# EAGLE design H-bro_gear (EAGLE 6.3)
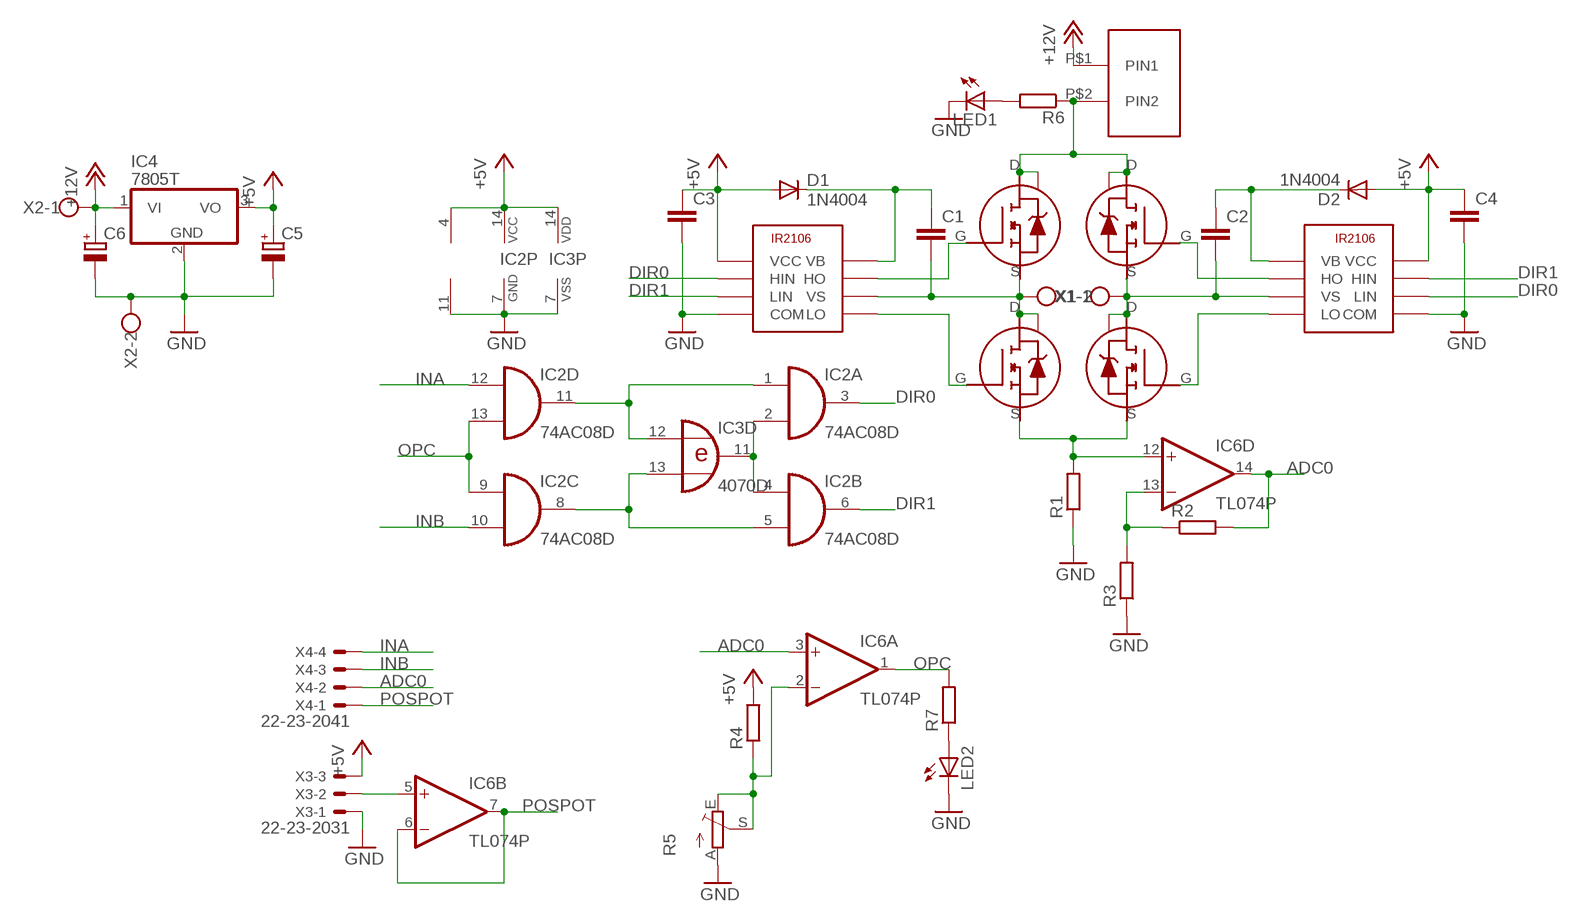
[diagram p0: schematic, sheet 1]

## Parts
C1  C-EU050-025X075  [C050-025X075]
C2  C-EU050-025X075  [C050-025X075]
C3  C-EU050-025X075  [C050-025X075]
C4  C-EU050-025X075  [C050-025X075]
C5  CPOL-EUE15-5AXIAL  [E15-5]
C6  CPOL-EUE15-5AXIAL  [E15-5]
D1  1N4004  [DO41-10]
D2  1N4004  [DO41-10]
IC2  74AC08D  [SO14]
IC3  4070D  [SO14]
IC4  7805T  [TO220H]
IC6  TL074P  [DIL14]
LED1  LED5MM  [LED5MM]
LED2  LED5MM  [LED5MM]
R1  R-EU_0309/12  [0309/12]
R2  R-EU_0204/7  [0204/7]
R3  R-EU_0204/7  [0204/7]
R4  R-EU_0204/7  [0204/7]
R5  TRIM_EU-RJ9W  [RJ9W]
R6  R-EU_0204/7  [0204/7]
R7  R-EU_0204/7  [0204/7]
U$1  IR2106  [IR2106]
U$2  IR2106  [IR2106]
U$3  STU95N5  [STU95N5]
U$4  STU95N5  [STU95N5]
U$5  STU95N5  [STU95N5]
U$6  STU95N5  [STU95N5]
U$7  LITTE_FUSE  [LITTE_FUSE_PAC]
X1  W237-102  [W237-102]
X2  W237-102  [W237-102]
X3  22-23-2031  [22-23-2031]
X4  22-23-2041  [22-23-2041]

## Nets
+5V: C3.1 C4.1 C5.+ D1.A D2.A IC2.14(P:VCC) IC3.14(P:VDD) IC4.3(VO) IC6.4(P:V+) R4.2 U$1.VCC U$2.VCC X3.3
+12V: C6.+ IC4.1(VI) U$7.P$1(PIN1) X2.1
ADC0: IC6.3(A:+IN) IC6.14(D:OUT) R2.2 X4.2
DIR0: IC2.3(A:O) U$1.HIN U$2.LIN
DIR1: IC2.6(B:O) U$1.LIN U$2.HIN
GND: C3.2 C4.2 C5.- C6.- IC2.7(P:GND) IC3.7(P:VSS) IC4.2(GND) IC6.11(P:V-) LED1.K(C) LED2.K(C) R1.1 R3.1 R5.A U$1.COM U$2.COM X2.2 X3.1
INA: IC2.12(D:I0) X4.4
INB: IC2.10(C:I1) X4.3
N$1: U$1.HO U$3.G
N$2: U$1.LO U$4.G
N$3: U$2.HO U$6.G
N$4: U$2.LO U$5.G
N$6: C1.2 U$1.VS U$3.S U$4.D U$4.TAB X1.2
N$7: C2.2 U$2.VS U$5.D U$5.TAB U$6.S X1.1
N$9: R6.1 U$3.D U$3.TAB U$6.D U$6.TAB U$7.P$2(PIN2)
N$10: C1.1 D1.C U$1.VB
N$11: IC6.12(D:+IN) R1.2 U$4.S U$5.S
N$13: C2.1 D2.C U$2.VB
N$15: IC2.2(A:I1) IC2.4(B:I0) IC3.11(D:O)
N$16: IC2.1(A:I0) IC2.11(D:O) IC3.12(D:I0)
N$17: IC2.5(B:I1) IC2.8(C:O) IC3.13(D:I1)
N$18: IC6.2(A:-IN) R4.1 R5.E R5.S
N$19: LED1.A R6.2
N$20: IC6.5(B:+IN) X3.2
N$21: IC6.13(D:-IN) R2.1 R3.2
N$22: LED2.A R7.1
OPC: IC2.9(C:I0) IC2.13(D:I1) IC6.1(A:OUT) R7.2
POSPOT: IC6.6(B:-IN) IC6.7(B:OUT) X4.1
Unconnected: IC3.1(A:I0) IC3.2(A:I1) IC3.3(A:O) IC3.4(B:O) IC3.5(B:I0) IC3.6(B:I1) IC3.8(C:I0) IC3.9(C:I1) IC3.10(C:O) IC6.8(C:OUT) IC6.9(C:-IN) IC6.10(C:+IN)

## Library data of the parts
C1-C4 = rcl:C-EU: CAPACITOR, European symbol
C5 C6 = rcl:CPOL-EU: POLARIZED CAPACITOR, European symbol
D1 D2 = diode:1N4004: DIODE general purpose rectifier, 1 A
IC2 = 74xx-eu:74*08: Quad 2-input AND gate
IC3 = 40xx:4070: Quad 2-input XOR
IC4 = linear:78*: Positive VOLTAGE REGULATOR Source: http://cache.national.com/ds/LM/LM78L05.pdf http://www.fairchildsemi.com/ds/LM/LM7805.pdf
IC6 = linear:TL074: OP AMP
LED1 LED2 = adafruit:LED: LED OSRAM: - CHIPLED LG R971, LG N971, LY N971, LG Q971, LY Q971, LO R971, LY R971 LH N974, LH R974 LS Q976, LO Q976, LY Q976 LO Q996 - Hyper CHIPLED LW Q18S LB Q993, LB Q99A, LB R99A - SideLED LS A670, LO A670, LY A670, LG A670, LP A670 LB A673, LV A673, LT A673, LW A673 LH A674 LY A675 LS A676, LA A676, LO A676, LY A676, LW A676 LS A679, LY A679, LG A679 - Hyper Micro SIDELED® LS Y876, LA Y876, LO Y876, LY Y876 LT Y87S - SmartLED LW L88C, LW L88S LB L89C, LB L89S, LG L890 LS L89K, LO L89K, LY L89K LS L896, LA L896, LO L896, LY L896 - TOPLED LS T670, LO T670, LY T670, LG T670, LP T670 LSG T670, LSP T670, LSY T670, LOP T670, LYG T670 LG T671, LOG T671, LSG T671 LB T673, LV T673, LT T673, LW T673 LH T674 LS T676, LA T676, LO T676, LY T676, LB T676, LH T676, LSB T676, LW T676 LB T67C, LV T67C, LT T67C, LS T67K, LO T67K, LY T67K, LW E67C LS E67B, LA E67B, LO E67B, LY E67B, LB E67C, LV E67C, LT E67C LW T67C LS T679, LY T679, LG T679 LS T770, LO T770, LY T770, LG T770, LP T770 LB T773, LV T773, LT T773, LW T773 LH T774 LS E675, LA E675, LY E675, LS T675 LS T776, LA T776, LO T776, LY T776, LB T776 LHGB T686 LT T68C, LB T68C - Hyper Mini TOPLED® LB M676 - Mini TOPLED Santana® LG M470 LS M47K, LO M47K, LY M47K Source: http://www.osram.convergy.de/
R1 = resistor:R-EU_: RESISTOR, European symbol
R2-R4 R6 R7 = rcl:R-EU_: RESISTOR, European symbol
R5 = pot:TRIM_EU-: POTENTIOMETER
U$1 U$2 = IR2106:IR2106; DEVICE: IR2106
U$3-U$6 = Brushless-motor-controller:STU95N5
U$7 = unicorn_v2:LITTE_FUSE
X1 X2 = con-wago-500:W237-102: WAGO SCREW CLAMP; MPN: 237-102; OC_FARNELL: unknown; OC_NEWARK: 70K9898
X3 = con-molex:22-23-2031: .100" (2.54mm) Center Header - 3 Pin; MF: MOLEX; MPN: 22-23-2031; OC_FARNELL: 1462950; OC_NEWARK: 30C0862
X4 = con-molex:22-23-2041: .100" (2.54mm) Center Header - 4 Pin; MF: MOLEX; MPN: 22-23-2041; OC_FARNELL: 1462920; OC_NEWARK: 38C0355

## Board
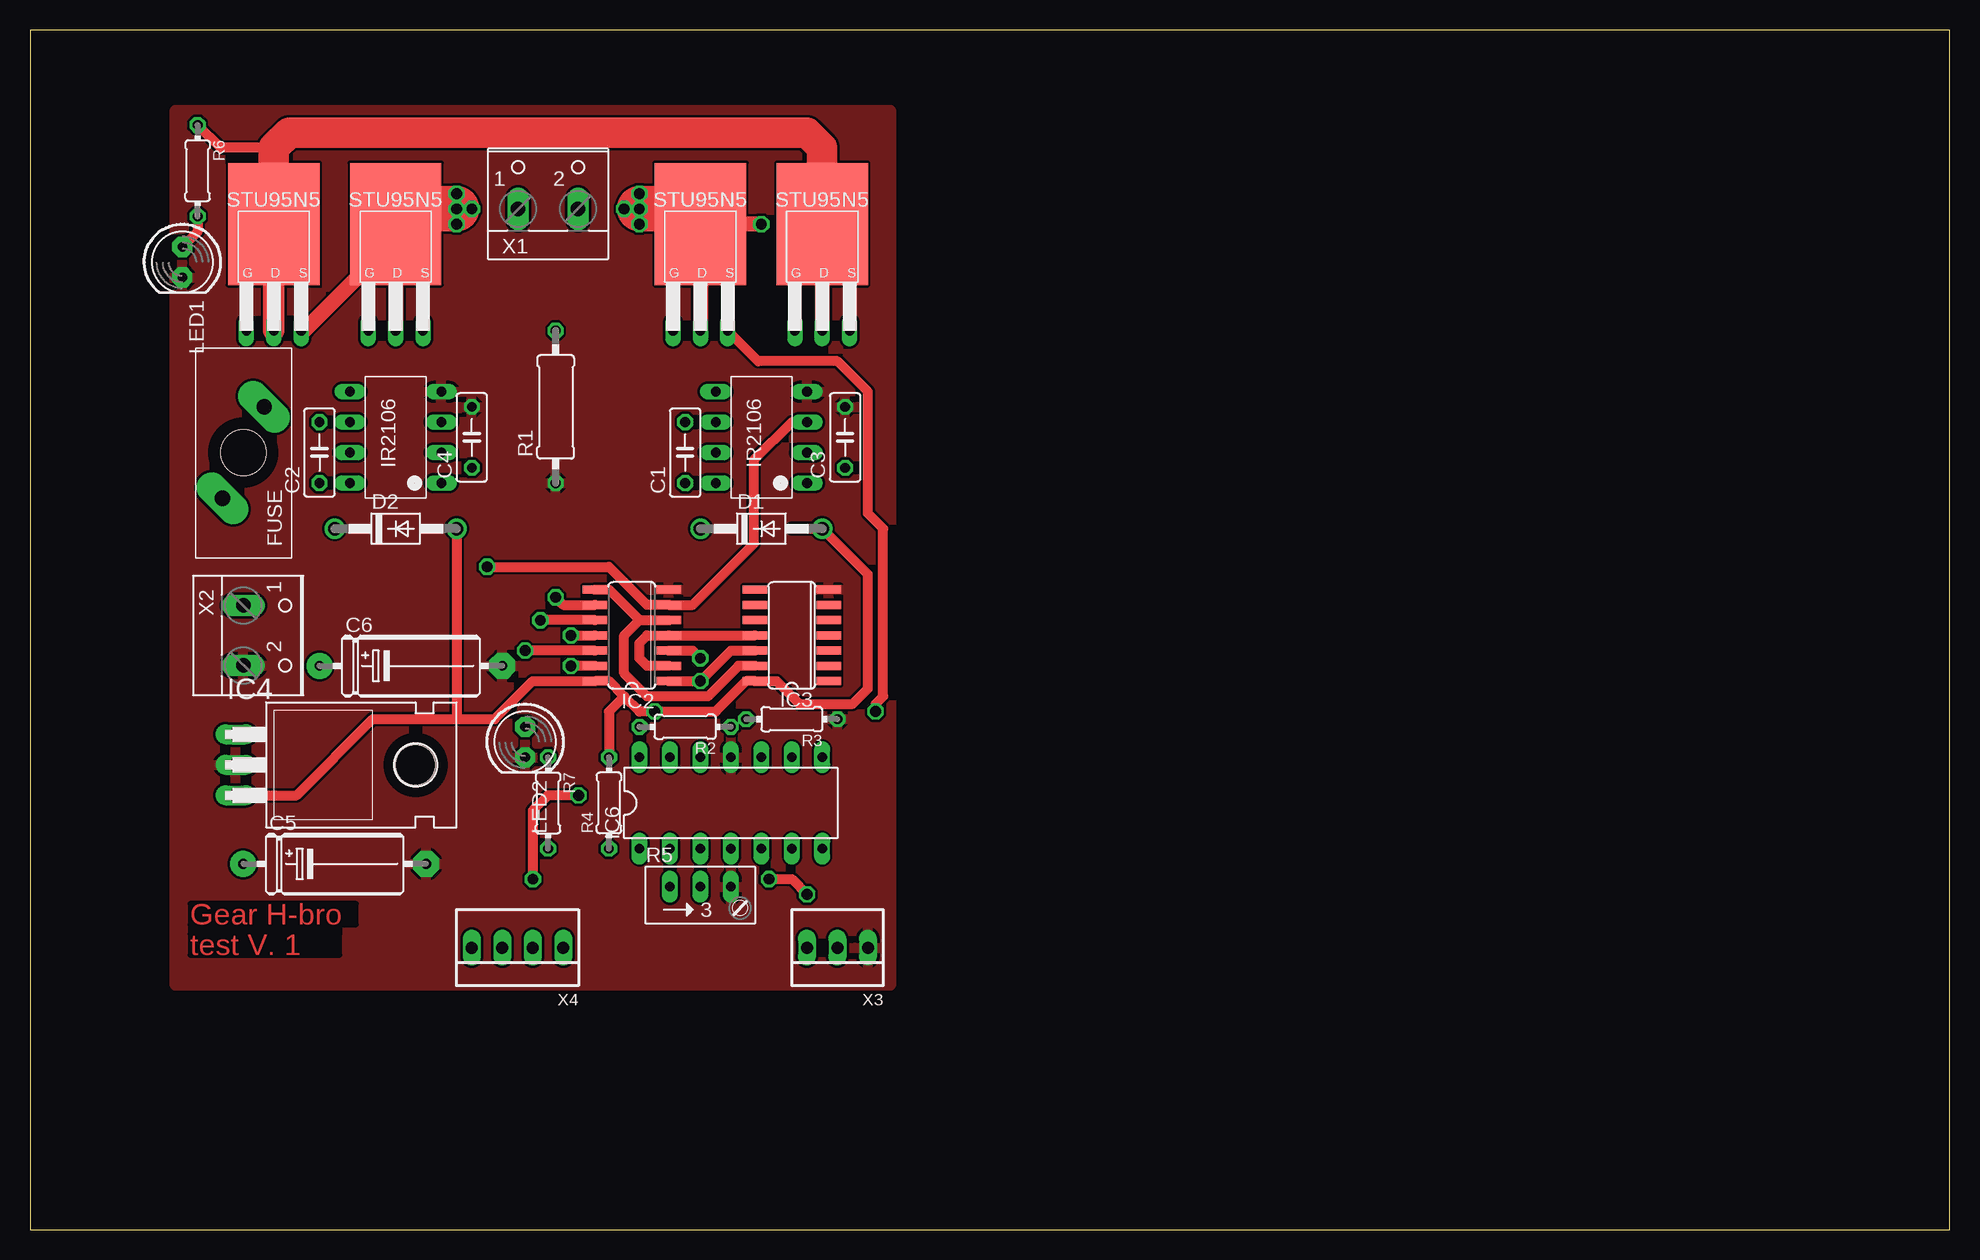
[diagram p1: board, top side]
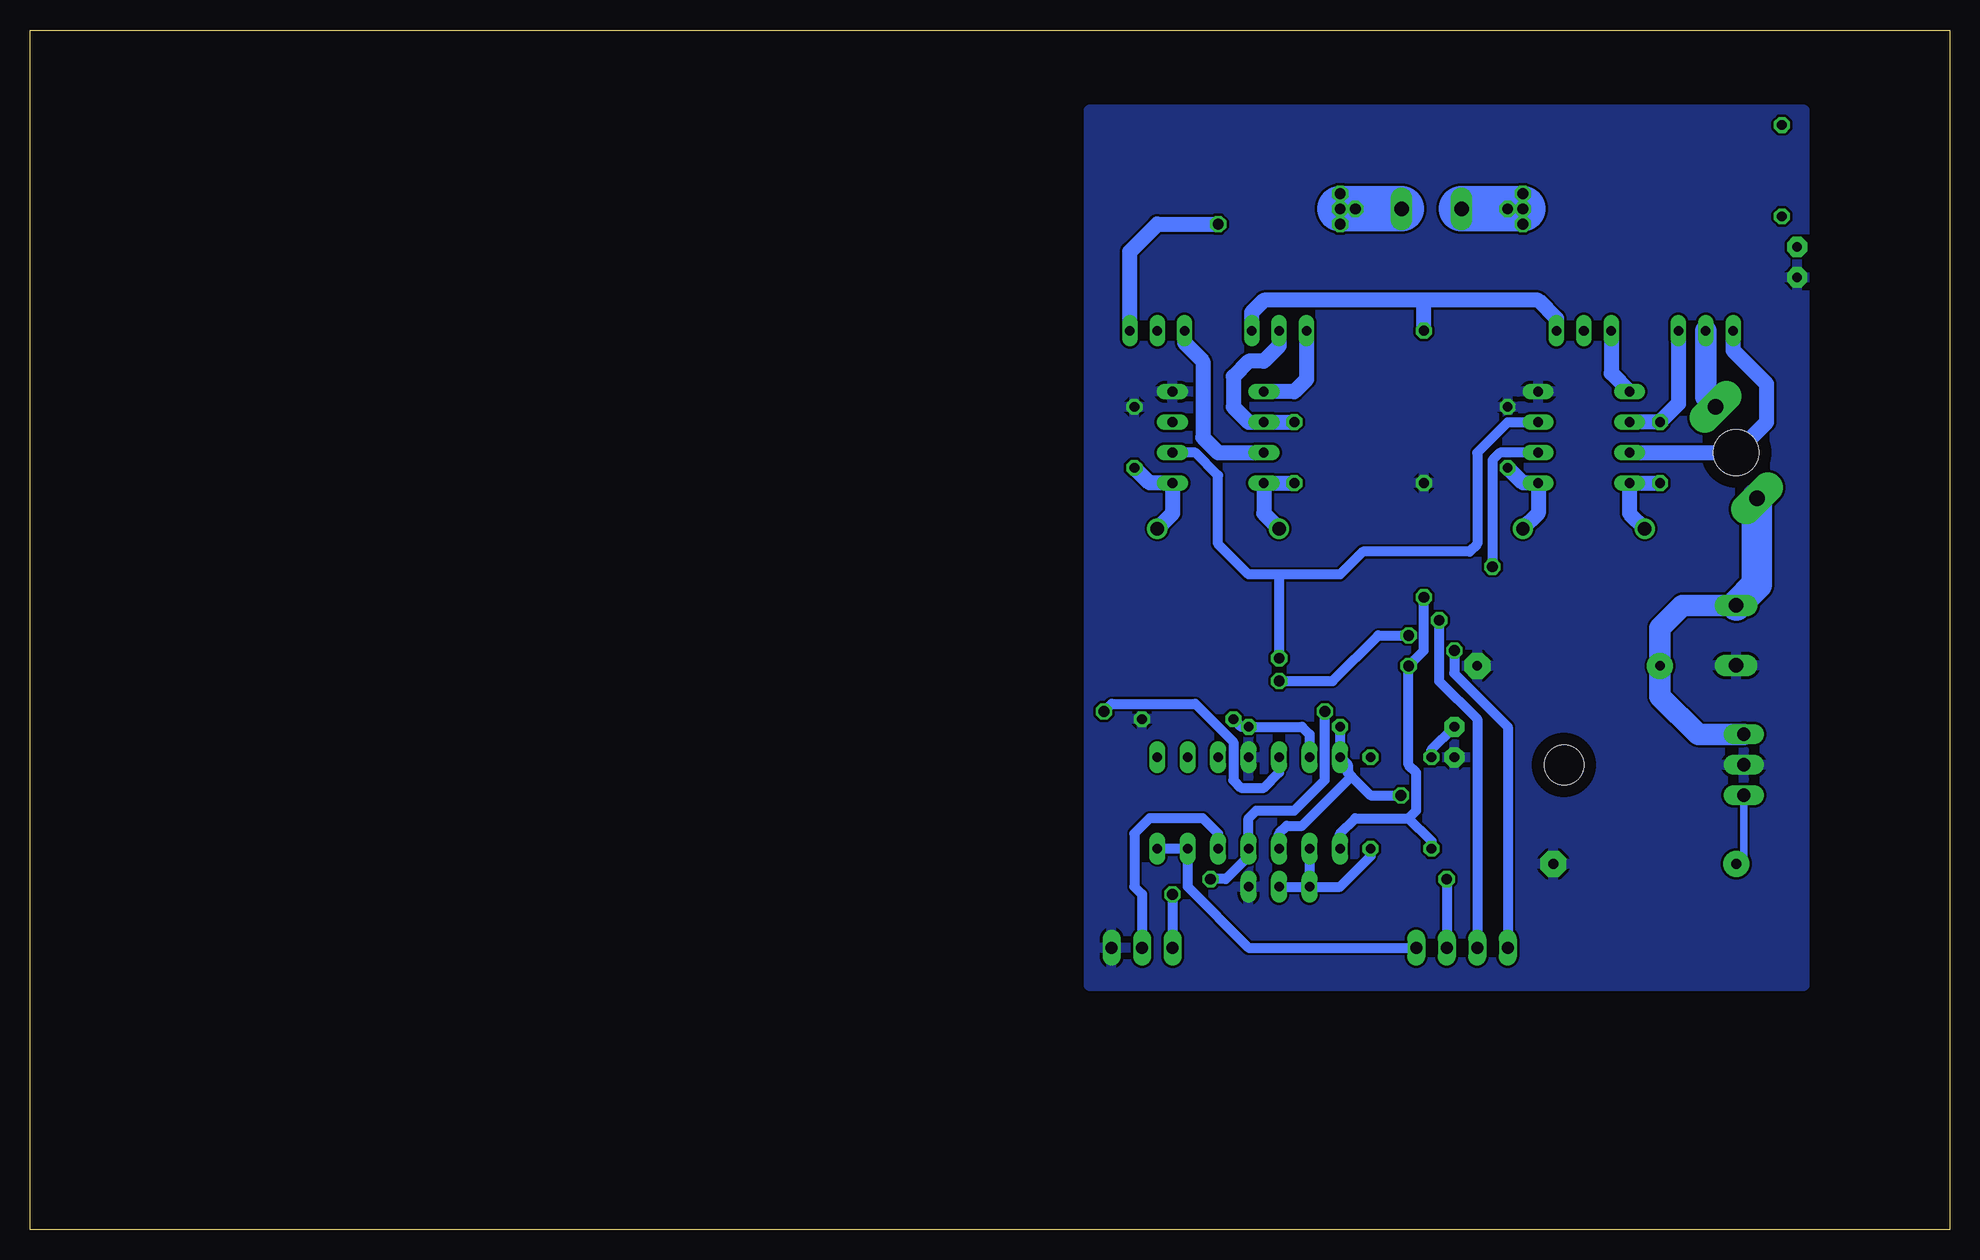
[diagram p2: board, bottom side, seen from below]

Size 160 x 100 mm. Coordinates in mm from the lower left corner, seen from the top.
Outline: 0,0 160,0 160,100 0,100 0,0
Copper layers (1*16): Top 0.035mm / dielectric 1.5mm / Bottom 0.035mm
Design rules "default": minimum track width 10mil, minimum drill 24mil, track to track 8mil, track to pad 8mil, pad to pad 8mil, via to via 8mil, smd to smd 8mil, copper to edge 40mil, drill to drill 8mil, minimum pad ring 10mil, minimum via ring 8mil, stop-mask expansion 4mil, vias tented up to drill 0mil, thermal gap 10mil

### Footprints (pad centres in the part's own frame; a part is rotated, then mirrored left to right if it is on the bottom)
C050-025X075 = drill 0.813 octagon: 1 -2.54,0; 2 2.54,0
E15-5 = drill 0.813 pad 2.159: + -7.62,0 | drill 0.813 pad 2.159 octagon: - 7.62,0
DO41-10 = drill 1.118: A 5.08,0; C -5.08,0
SO14 = smd 0.66 x 2.032: 1 -3.81,-3.073; 2 -2.54,-3.073; 3 -1.27,-3.073; 4 0,-3.073; 5 1.27,-3.073; 6 2.54,-3.073; 7 3.81,-3.073; 8 3.81,3.073; 9 2.54,3.073; 10 1.27,3.073; 11 0,3.073; 12 -1.27,3.073; 13 -2.54,3.073; 14 -3.81,3.073
TO220H = drill 1.118 long: 1 -2.54,-10.16; 2 0,-10.16; 3 2.54,-10.16 | hole 3.302: 0,4.826
DIL14 = drill 0.813 long: 1 -7.62,-3.81; 2 -5.08,-3.81; 3 -2.54,-3.81; 4 0,-3.81; 5 2.54,-3.81; 6 5.08,-3.81; 7 7.62,-3.81; 8 7.62,3.81; 9 5.08,3.81; 10 2.54,3.81; 11 0,3.81; 12 -2.54,3.81; 13 -5.08,3.81; 14 -7.62,3.81
LED5MM = drill 0.813 pad 1.676 octagon: A -1.27,0; K 1.27,0
0309/12 = drill 0.813 octagon: 1 -6.35,0; 2 6.35,0
0204/7 = drill 0.813 octagon: 1 -3.81,0; 2 3.81,0
RJ9W = drill 0.813 long: A 2.54,0.635; E -2.54,0.635; S 0,0.635
IR2106 = drill 0.8 long: COM 3.81,-3.81; HIN -1.27,-3.81; HO -1.27,3.81; LIN 1.27,-3.81; LO 3.81,3.81; VB -3.81,3.81; VCC -3.81,-3.81; VS 1.27,3.81
STU95N5 = drill 0.8 long: D 0,0; G -2.28,0; S 2.28,0 | smd 7.62 x 10.16: TAB 0,8.89
LITTE_FUSE_PAC = drill 1.27 pad 2.54 long: P$1 -1.73,-3.81; P$2 1.73,3.81 | hole 3.78: 0,0
W237-102 = drill 1.194 long: 1 -2.5,-1.27; 2 2.5,-1.27
22-23-2031 = drill 1 long: 1 -2.54,0; 2 0,0; 3 2.54,0
22-23-2041 = drill 1 long: 1 -3.81,0; 2 -1.27,0; 3 1.27,0; 4 3.81,0

### Placement (x,y rotation side)
C1  54.61,64.77 90 top
C2  24.13,64.77 90 top
C3  67.94,66.04 90 top
C4  36.83,66.04 90 top
C5  25.4,30.48 0 top
C6  31.75,46.99 0 top
D1  60.96,58.42 0 top
D2  30.48,58.42 0 top
IC2  50.16,49.53 90 top
IC3  63.5,49.53 90 top
IC4  27.3,38.73 270 top
IC6  58.42,35.56 0 top
LED1  12.7,80.64 270 top
LED2  41.27,40.64 270 top
R1  43.81,68.58 90 top
R2  54.61,41.91 180 top
R3  63.5,42.55 180 top
R4  48.26,35.56 90 top
R5  55.88,27.94 0 top
R6  13.97,88.27 270 top
R7  43.18,35.56 270 top
U$1  60.96,66.04 90 top
U$2  30.48,66.04 90 top
U$3  66.04,74.93 0 top
U$4  55.88,74.93 0 top
U$5  30.48,74.93 0 top
U$6  20.32,74.93 0 top
U$7  17.78,64.77 0 top
X1  43.18,86.36 0 top
X2  19.05,49.53 270 top
X3  67.31,23.5 180 top
X4  40.64,23.5 180 top

### Tracks (layer width: path | path; a pad name or v marks a point on that pad's centre or on a via)
+5V  (via drill 0.9)
  Top 0.813: 49.53,44.45 48.26,45.72 IC2.14 41.91,45.72 38.73,42.55 35.56,42.55 | 63.5,58.42 D1.A 69.85,54.61 69.85,45.09 68.58,43.81 64.14,43.81 62.23,45.72 IC3.14 59.69,45.72 57.15,43.18 v52.07,43.18 50.8,43.18 49.53,44.45 | 49.53,44.45 48.26,43.18 R4.2 | IC4.3 22.23,36.2 28.57,42.55 35.56,42.55 | D2.A 35.56,42.55 | v61.59,29.21 63.5,29.21 v64.77,27.94
  Bottom 0.61: C5.+ 17.14,31.11 IC4.3
  Bottom 0.813: v52.07,43.18 52.07,37.47 54.61,34.92 57.78,34.92 58.42,34.29 IC6.4 58.42,31.11 60.33,29.21 v61.59,29.21 | v64.77,27.94 X3.3
  Bottom 1.27: D2.A 34.29,59.69 U$2.VCC 35.56,62.23 C4.1 | D1.A 64.77,59.69 U$1.VCC 66.67,62.23 C3.1
+12V
  Bottom 1.778: X2.1 22.27,52.03 24.13,50.16 C6.+ 24.13,44.45 20.95,41.27 IC4.1
  Bottom 2.54: U$7.P$1 16.05,53.76 X2.1
ADC0  (via drill 0.9)
  Top 0.813: v45.72,36.2 43.18,36.2 41.91,34.92 v41.91,29.21
  Bottom 0.813: R2.2 IC6.14 50.16,38.73 50.16,38.1 49.85,37.78 | 49.85,37.78 48.26,36.2 v45.72,36.2 | IC6.3 55.88,33.02 55.24,33.66 53.98,33.66 49.85,37.78 | v41.91,29.21 X4.2
DIR0  (via drill 0.9)
  Top 0.813: IC2.3 55.24,48.26 v55.88,47.62
  Bottom 0.813: U$1.HIN 62.87,64.77 60.96,62.87 60.96,57.15 58.42,54.61 56.52,54.61 55.88,54.61 | U$2.LIN 36.83,67.31 39.37,64.77 39.37,57.15 40.01,56.52 48.9,56.52 50.8,54.61 55.88,54.61 | 55.88,54.61 v55.88,47.62
DIR1  (via drill 0.9)
  Top 0.813: U$1.LIN 63.5,67.31 60.33,64.14 60.33,57.15 55.24,52.07 IC2.6 51.44,52.07 48.26,55.24 v38.1,55.24
  Bottom 0.813: U$2.HIN 37.47,64.77 38.1,64.14 v38.1,55.24
GND
  pour Top: 12.06,93.34 71.75,93.34 71.75,20.32 12.06,20.32
  pour Bottom: 12.06,93.34 71.75,93.34 71.75,20.32 12.06,20.32
INA  (via drill 0.9)
  Top 0.813: IC2.12 v41.27,48.26
  Bottom 0.813: v41.27,48.26 41.27,46.35 36.83,41.91 X4.4
INB  (via drill 0.9)
  Top 0.813: IC2.10 v42.55,50.8
  Bottom 0.813: v42.55,50.8 42.55,45.72 39.37,42.55 X4.3
N$1
  Bottom 1.27: U$3.G 63.76,73.92 62.23,72.39 62.23,66.04 60.96,64.77 U$1.HO
N$2
  Bottom 1.27: U$4.G 53.6,70.86 54.61,69.85 U$1.LO
N$3
  Bottom 1.27: U$2.HO 17.78,64.77 15.24,67.31 15.24,70.48 18.04,73.28 U$6.G
N$4
  Bottom 1.27: U$5.G 28.2,71.38 U$2.LO
N$5  (via drill 0.9)
  other vias: 35.56,86.36
N$6  (via drill 0.9)
  Top 1.27: U$4.D U$4.TAB v60.96,83.82
  Top 3.81: U$4.TAB 54.61,85.09 v50.8,85.09
  Bottom 1.27: U$4.D 55.88,73.66 57.15,72.39 58.42,72.39 59.69,71.12 59.69,68.58 58.42,67.31 U$1.VS C1.2 | U$3.S 68.32,81.54 66.04,83.82 v60.96,83.82
  Bottom 3.81: v50.8,85.09 v49.53,85.09 X1.2
N$7  (via drill 0.9)
  Top 1.27: U$5.TAB 30.48,82.55 | 30.48,82.55 U$5.D | U$6.S 22.86,74.93 30.48,82.55
  Top 3.81: U$5.TAB 31.75,85.09 v35.56,85.09
  Bottom 1.27: U$6.S 22.6,68.84 C2.2 U$2.VS
  Bottom 3.81: v35.56,85.09 v36.83,85.09 X1.1
N$8  (via drill 0.9)
  other vias: 35.56,83.82
N$9
  Top 0.813: 20.32,90.17 15.88,90.17 R6.1 | U$3.TAB 66.36,84.14
  Top 1.27: U$3.TAB U$3.D
  Top 1.778: U$6.TAB U$6.D
  Top 2.54: U$6.TAB 20.32,90.17 21.59,91.44 64.77,91.44 66.04,90.17 66.04,84.45 66.36,84.14 66.67,83.82
  Bottom 1.778: U$7.P$2 20.32,69.39 U$6.D
N$10
  Bottom 1.27: D1.C 57.15,59.69 U$1.VB C1.1
N$11  (via drill 0.9)
  Top 0.813: U$4.S 60.7,72.39 67.31,72.39 69.85,69.85 69.85,59.69 71.12,58.42 71.12,44.45 70.48,43.81 v70.48,43.18
  Bottom 0.813: v70.48,43.18 69.85,43.81 62.87,43.81 59.69,40.64 59.69,37.47 59.05,36.83 57.15,36.83 55.88,38.1 IC6.12
  Bottom 1.27: U$4.S 58.16,76.46 57.15,77.47 43.81,77.47 | U$5.S 32.76,75.94 34.29,77.47 43.81,77.47 | R1.2 43.81,77.47
N$12  (via drill 0.9)
  other vias: 50.8,86.36
N$13
  Bottom 1.27: D2.C 26.67,59.69 U$2.VB C2.1
N$14  (via drill 0.9)
  other vias: 50.8,83.82
N$15
  Top 0.813: IC2.2 51.44,46.99 50.8,47.62 50.8,48.9 51.44,49.53 IC2.4 IC3.11
N$16  (via drill 0.9)
  Top 0.813: IC3.12 58.42,48.26 v55.88,45.72 IC2.1 | v45.09,49.53 IC2.11
  Bottom 0.813: v55.88,45.72 51.44,45.72 47.62,49.53 v45.09,49.53
N$17
  Top 0.813: IC3.13 59.05,46.99 56.52,44.45 51.44,44.45 49.53,46.35 49.53,49.53 50.8,50.8 | 50.8,50.8 IC2.5 | IC2.8 48.26,53.34 50.8,50.8
N$18
  Bottom 0.813: R5.S R5.E | R5.E 50.8,28.57 48.26,31.11 R4.1 | IC6.2 R5.E
N$19
  Top 0.813: R6.2 13.97,83.19 LED1.A
N$20
  Bottom 0.813: IC6.5 60.96,33.02 62.23,34.29 66.67,34.29 67.94,33.02 67.94,28.57 67.31,27.94 X3.2
N$21
  Bottom 0.813: IC6.13 53.34,41.27 53.98,41.91 R2.1 59.05,41.91 R3.2
N$22
  Bottom 0.813: R7.1 43.18,40.01 LED2.A
OPC  (via drill 0.9)
  Top 0.813: v43.81,52.7 44.45,52.07 IC2.9 | IC2.13 v45.09,46.99
  Bottom 0.813: IC6.1 50.8,33.02 49.53,34.29 45.09,34.29 | 45.09,34.29 44.45,34.92 44.45,38.1 45.09,38.73 v45.09,46.99 43.81,48.26 v43.81,52.7 | R7.2 43.18,32.38 45.09,34.29
POSPOT
  Bottom 0.813: IC6.7 IC6.6 63.5,28.57 58.42,23.5 X4.1

### Text on the board
Top: Gear H-bro | test V. 1